# EAGLE design power (EAGLE 5.10)
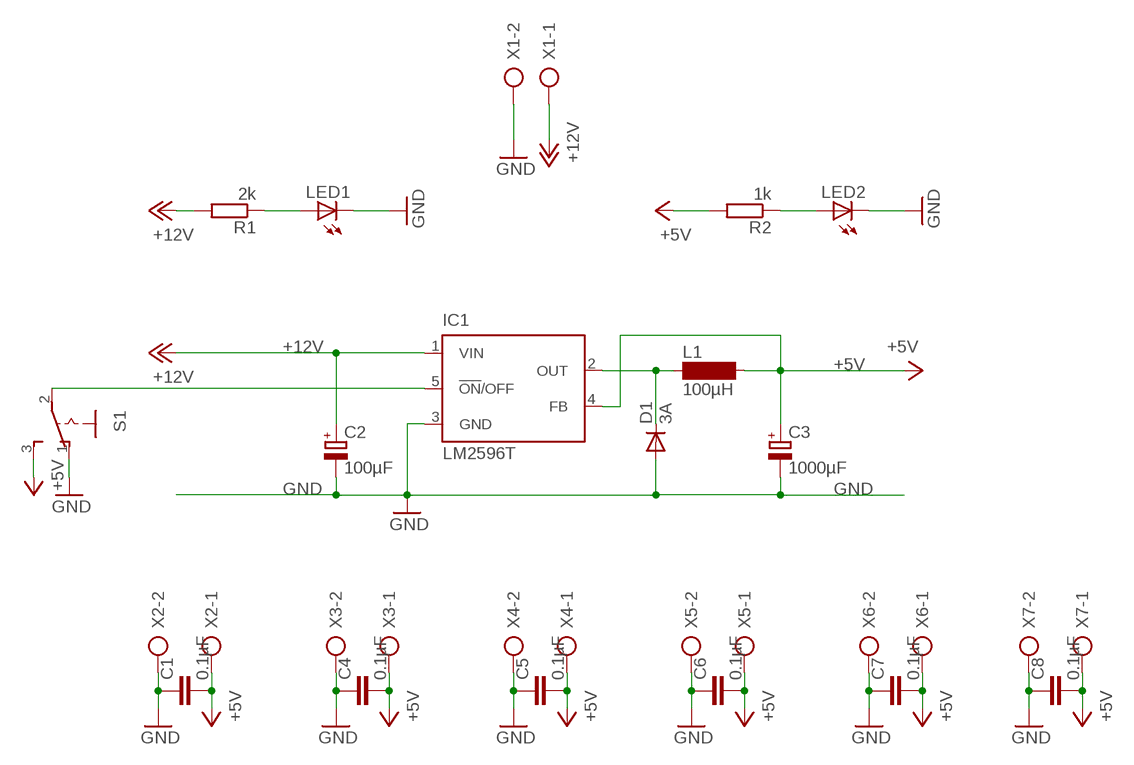
[diagram p0: schematic, sheet 1]

## Parts
C1  0.1µF  C-EU050-024X044  [C050-024X044]
C2  100µF  CPOL-EUE2.5-7  [E2,5-7]
C3  1000µF  CPOL-EUE3.5-10  [E3,5-10]
C4  0.1µF  C-EU050-024X044  [C050-024X044]
C5  0.1µF  C-EU050-024X044  [C050-024X044]
C6  0.1µF  C-EU050-024X044  [C050-024X044]
C7  0.1µF  C-EU050-024X044  [C050-024X044]
C8  0.1µF  C-EU050-024X044  [C050-024X044]
D1  3A  DIODE-DO27-15  [DO27-15]
IC1  LM2596T  [T05D]
L1  100µH  BS11  [BS11]
LED1  LEDCHIPLED_1206  [CHIPLED_1206]
LED2  LEDCHIPLED_1206  [CHIPLED_1206]
R1  2k  R-EU_M0805  [M0805]
R2  1k  R-EU_M0805  [M0805]
S1  255SB  [255SB]
X1  AK500/2  [AK500/2]
X2  AK500/2  [AK500/2]
X3  AK500/2  [AK500/2]
X4  AK500/2  [AK500/2]
X5  AK500/2  [AK500/2]
X6  AK500/2  [AK500/2]
X7  AK500/2  [AK500/2]

## Nets
+5V: C1.2 C3.+ C4.2 C5.2 C6.2 C7.2 C8.2 IC1.4(FB) L1.2 R2.2 S1.3(S) X2.1 X3.1 X4.1 X5.1 X6.1 X7.1
+12V: C2.+ IC1.1(VIN) R1.2 X1.1
GND: C1.1 C2.- C3.- C4.1 C5.1 C6.1 C7.1 C8.1 D1.A IC1.3(GND) LED1.C LED2.C S1.1(O) X1.2 X2.2 X3.2 X4.2 X5.2 X6.2 X7.2
N$1: LED1.A R1.1
N$2: LED2.A R2.1
N$3: IC1.5(!ON!/OFF) S1.2(P)
N$4: D1.C IC1.2(OUT) L1.1

## Library data of the parts
C1 C4-C8 = rcl:C-EU: CAPACITOR, European symbol
C2 C3 = rcl:CPOL-EU: POLARIZED CAPACITOR, European symbol
D1 = diode:DIODE-: DIODE
IC1 = national-semiconductor:LM2596: SIMPLE SWITCHER® Power Converter 150 kHz 3A Step-Down Voltage Regulator Source: http://www.national.com/ds/LM/LM2596.pdf; MPN: LM2596T-ADJ/LF02; OC_FARNELL: 9494162; OC_NEWARK: 65K5910
L1 = inductor-neosid:BS: INDUCTOR nominal inductance, magnetically screened; OC_FARNELL: unknown; OC_NEWARK: unknown
LED1 LED2 = led:LED: LED OSRAM: - CHIPLED LG R971, LG N971, LY N971, LG Q971, LY Q971, LO R971, LY R971 LH N974, LH R974 LS Q976, LO Q976, LY Q976 LO Q996 - Hyper CHIPLED LW Q18S LB Q993, LB Q99A, LB R99A - SideLED LS A670, LO A670, LY A670, LG A670, LP A670 LB A673, LV A673, LT A673, LW A673 LH A674 LY A675 LS A676, LA A676, LO A676, LY A676, LW A676 LS A679, LY A679, LG A679 - Hyper Micro SIDELED® LS Y876, LA Y876, LO Y876, LY Y876 LT Y87S - SmartLED LW L88C, LW L88S LB L89C, LB L89S, LG L890 LS L89K, LO L89K, LY L89K LS L896, LA L896, LO L896, LY L896 - TOPLED LS T670, LO T670, LY T670, LG T670, LP T670 LSG T670, LSP T670, LSY T670, LOP T670, LYG T670 LG T671, LOG T671, LSG T671 LB T673, LV T673, LT T673, LW T673 LH T674 LS T676, LA T676, LO T676, LY T676, LB T676, LH T676, LSB T676, LW T676 LB T67C, LV T67C, LT T67C, LS T67K, LO T67K, LY T67K, LW E67C LS E67B, LA E67B, LO E67B, LY E67B, LB E67C, LV E67C, LT E67C LW T67C LS T679, LY T679, LG T679 LS T770, LO T770, LY T770, LG T770, LP T770 LB T773, LV T773, LT T773, LW T773 LH T774 LS E675, LA E675, LY E675, LS T675 LS T776, LA T776, LO T776, LY T776, LB T776 LHGB T686 LT T68C, LB T68C - Hyper Mini TOPLED® LB M676 - Mini TOPLED Santana® LG M470 LS M47K, LO M47K, LY M47K Source: http://www.osram.convergy.de LUXEON: - LUMILED® LXK2-PW12-R00, LXK2-PW12-S00, LXK2-PW14-U00, LXK2-PW14-V00 LXK2-PM12-R00, LXK2-PM12-S00, LXK2-PM14-U00 LXK2-PE12-Q00, LXK2-PE12-R00, LXK2-PE12-S00, LXK2-PE14-T00, LXK2-PE14-U00 LXK2-PB12-K00, LXK2-PB12-L00, LXK2-PB12-M00, LXK2-PB14-N00, LXK2-PB14-P00, LXK2-PB14-Q00 LXK2-PR12-L00, LXK2-PR12-M00, LXK2-PR14-Q00, LXK2-PR14-R00 LXK2-PD12-Q00, LXK2-PD12-R00, LXK2-PD12-S00 LXK2-PH12-R00, LXK2-PH12-S00 LXK2-PL12-P00, LXK2-PL12-Q00, LXK2-PL12-R00 Source: www.luxeon.com KINGBRIGHT: KA-3528ASYC Source: www.kingbright.com
R1 R2 = rcl:R-EU_: RESISTOR, European symbol
S1 = switch:255SB: SLIDING SWITCH Distributor Buerklin, 11G810
X1-X7 = con-ptr500:AK500/2: CONNECTOR; OC_FARNELL: unknown; OC_NEWARK: unknown

## Board
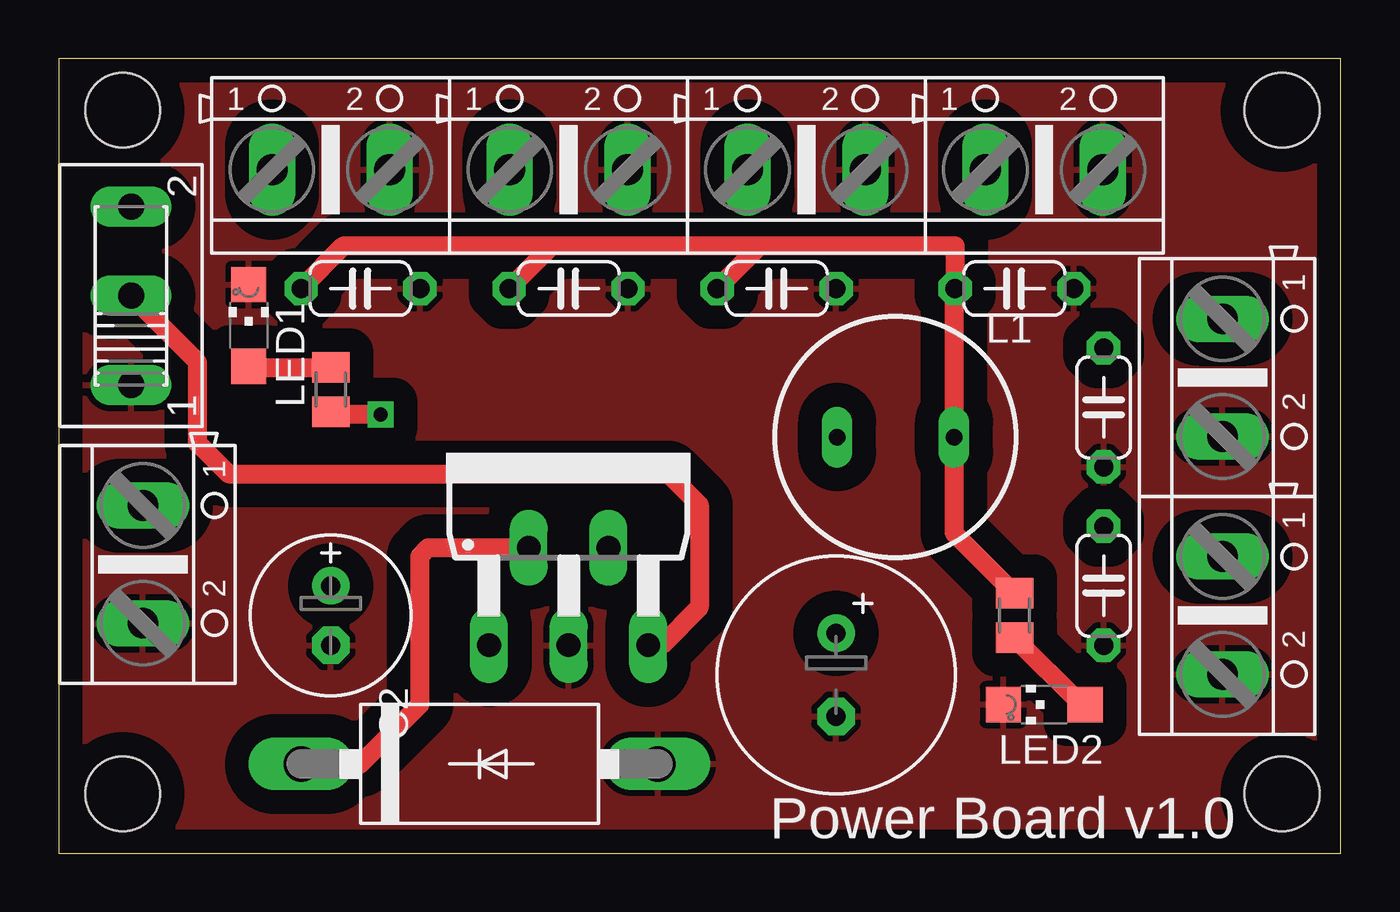
[diagram p1: board, top side]
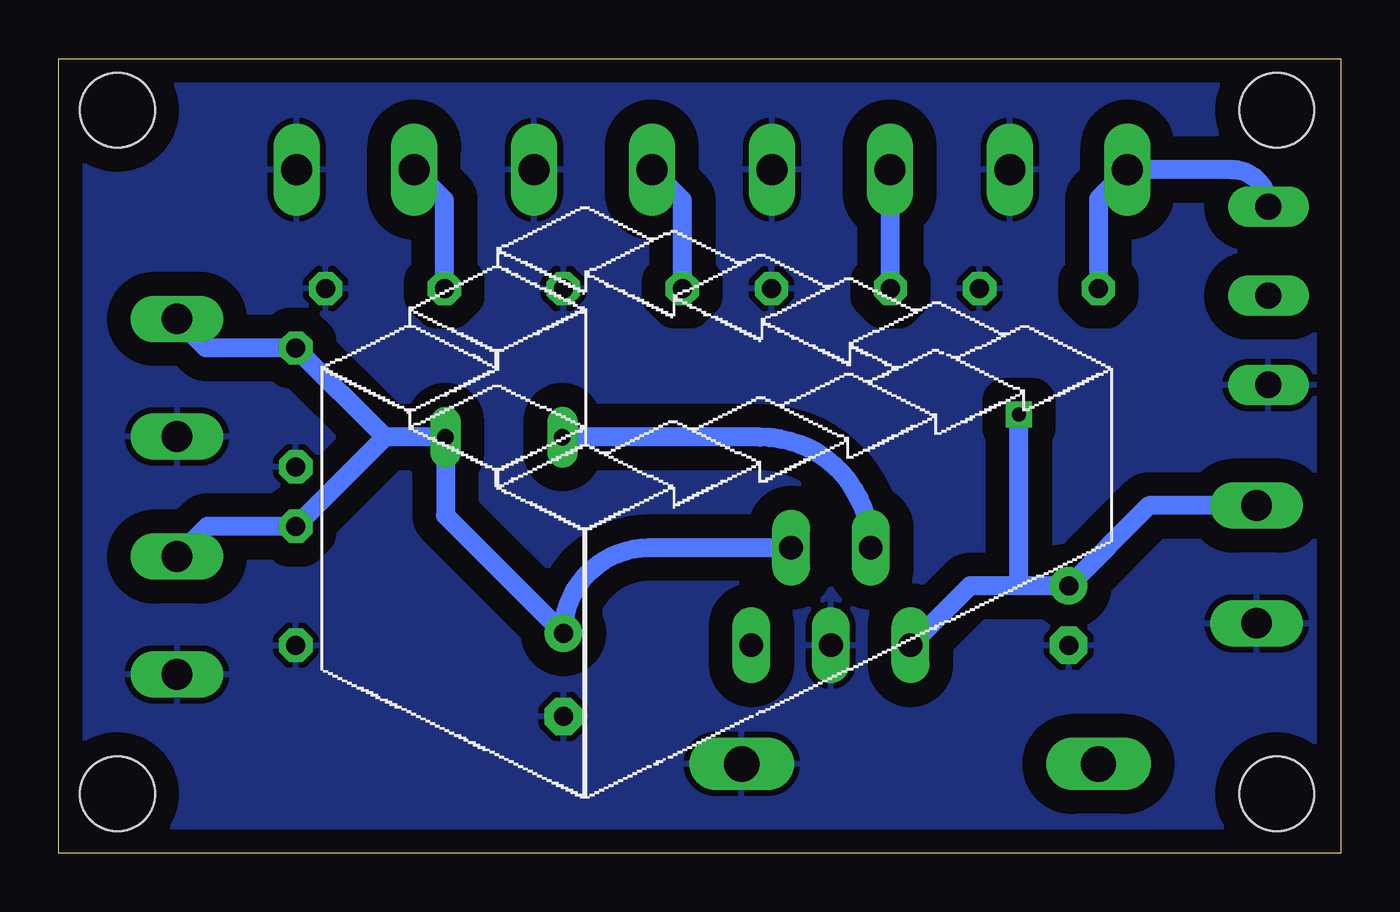
[diagram p2: board, bottom side, seen from below]

Size 54.79 x 33.96 mm. Coordinates in mm from the lower left corner, seen from the top.
Outline: 0,0 54.79,0 54.79,33.96 0,33.96 0,0
Copper layers (1*16): Top 0.035mm / dielectric 1.5mm / Bottom 0.035mm
Design rules "SparkFun": minimum track width 8mil, minimum drill 20mil, track to track 8mil, track to pad 8mil, pad to pad 8mil, via to via 8mil, smd to smd 8mil, copper to edge 10mil, drill to drill 8mil, minimum pad ring 12mil, minimum via ring 10mil, stop-mask expansion 4mil, vias tented up to drill 25mil, thermal gap 10mil
Holes 3.2 mm at 52.27,2.54 2.74,2.54 2.74,31.75 52.27,31.75

### Footprints (pad centres in the part's own frame; a part is rotated, then mirrored left to right if it is on the bottom)
C050-024X044 = drill 0.813 octagon: 1 -2.54,0; 2 2.54,0
E2,5-7 = drill 0.813 pad 1.6 round: + -1.27,0 | drill 0.813 pad 1.6 octagon: - 1.27,0
E3,5-10 = drill 0.813 pad 1.6 round: + -1.778,0 | drill 0.813 pad 1.6 octagon: - 1.778,0
DO27-15 = drill 1.499 long: A 7.62,0; C -7.62,0
T05D = drill 1.016 long: 1 -3.404,-5.08; 2 -1.702,-0.914; 3 0,-5.08; 4 1.702,-0.914; 5 3.404,-5.08
BS11 = drill 0.7 long: 1 -2.5,0; 2 2.5,0
CHIPLED_1206 = smd 1.5 x 1.5: A 0,-1.75; C 0,1.75
M0805 = smd 1.3 x 1.6: 1 -0.95,0; 2 0.95,0
255SB = drill 1.118 long: 1 -3.81,0; 2 0,0; 3 3.81,0
AK500/2 = drill 1.321 long: 1 -2.515,0; 2 2.515,0

### Placement (x,y rotation side)
C1  12.9,24.13 180 top
C2  11.63,10.16 270 top
C3  33.22,7.62 270 top
C4  44.65,11.43 90 top
C5  44.65,19.05 90 top
C6  30.68,24.13 180 top
C7  21.79,24.13 180 top
C8  40.84,24.13 180 top
D1  17.98,3.81 0 top
IC1  21.79,13.97 0 top
L1  35.76,17.78 0 top
LED1  8.13,22.56 0 top
LED2  42.11,6.35 90 top
R1  11.63,19.81 270 top
R2  40.84,10.16 90 top
S1  3.1,23.83 90 top
X1  3.61,12.34 270 top
X2  11.63,29.21 0 top
X3  21.79,29.21 0 top
X4  31.95,29.21 0 top
X5  49.73,20.32 270 top
X6  42.11,29.21 0 top
X7  49.73,10.16 270 top

### Tracks (layer width: path | path; a pad name or v marks a point on that pad's centre or on a via)
+5V
  Top 0.813: R2.2 38.26,13.69 L1.2 38.26,24.09 C8.2 38.3,25.96 30.84,25.96 29.97,25.96 | C1.2 12.19,25.96 21.08,25.96 | 21.08,25.96 C7.2 | 21.08,25.96 29.97,25.96 | 29.97,25.96 C6.2
  Bottom 0.813: IC1.4 29.57,13.06 arc-90 C3.+ 38.26,14.44 L1.2 40.84,17.78 | X7.1 48.44,13.97 C4.2 40.84,17.78 | X5.1 48.49,21.59 C5.2 40.84,17.78 | X6.1 38.3,27.91 C8.2 | X4.1 28.14,27.91 C6.2 | X3.1 19.25,29.19 C7.2 | C1.2 10.36,27.97 X2.1 4.67,29.21 arc90 S1.3
+12V  (via drill 0.6)
  Top 0.813: R1.2 11.75,18.75 v13.77,18.75
  Bottom 0.813: X1.1 8.2,14.86 C2.+ 13.77,11.43 | 13.77,11.43 15.85,11.43 IC1.1 | 13.77,11.43 v13.77,18.75
GND
  pour Bottom (isolate 1.016): 0.05,33.99 54.81,33.99 54.81,0.05 0.05,0.05
  pour Top (isolate 1.016): 0.05,33.99 54.81,33.99 54.81,0.05 0.05,0.05
N$1
  Top 0.813: LED1.A 8.17,20.76 R1.1
N$2
  Top 0.813: R2.1 43.7,6.35 LED2.A
N$3
  Top 0.813: S1.2 5.94,20.98 5.94,17.53 7.26,16.2 26.06,16.2 27.38,14.88 27.38,10.52 25.76,8.89 IC1.5
N$4
  Top 0.813: D1.C 12.9,3.81 15.44,6.35 15.44,12.7 15.8,13.06 IC1.2
  Bottom 0.813: L1.1 24.82,17.78 arc90 IC1.2

### Text on the board
tNames: Power Board v1.0